# EasyEDA schematic SCH_Probador-de-continuidad-con-NE-555_2026-01-26.json
TITLE: Sheet_1; REV: 1.0; Date: 2025-10-20; Sheet: 1/1; Drawn By: nalaronipin; Company: Your Company
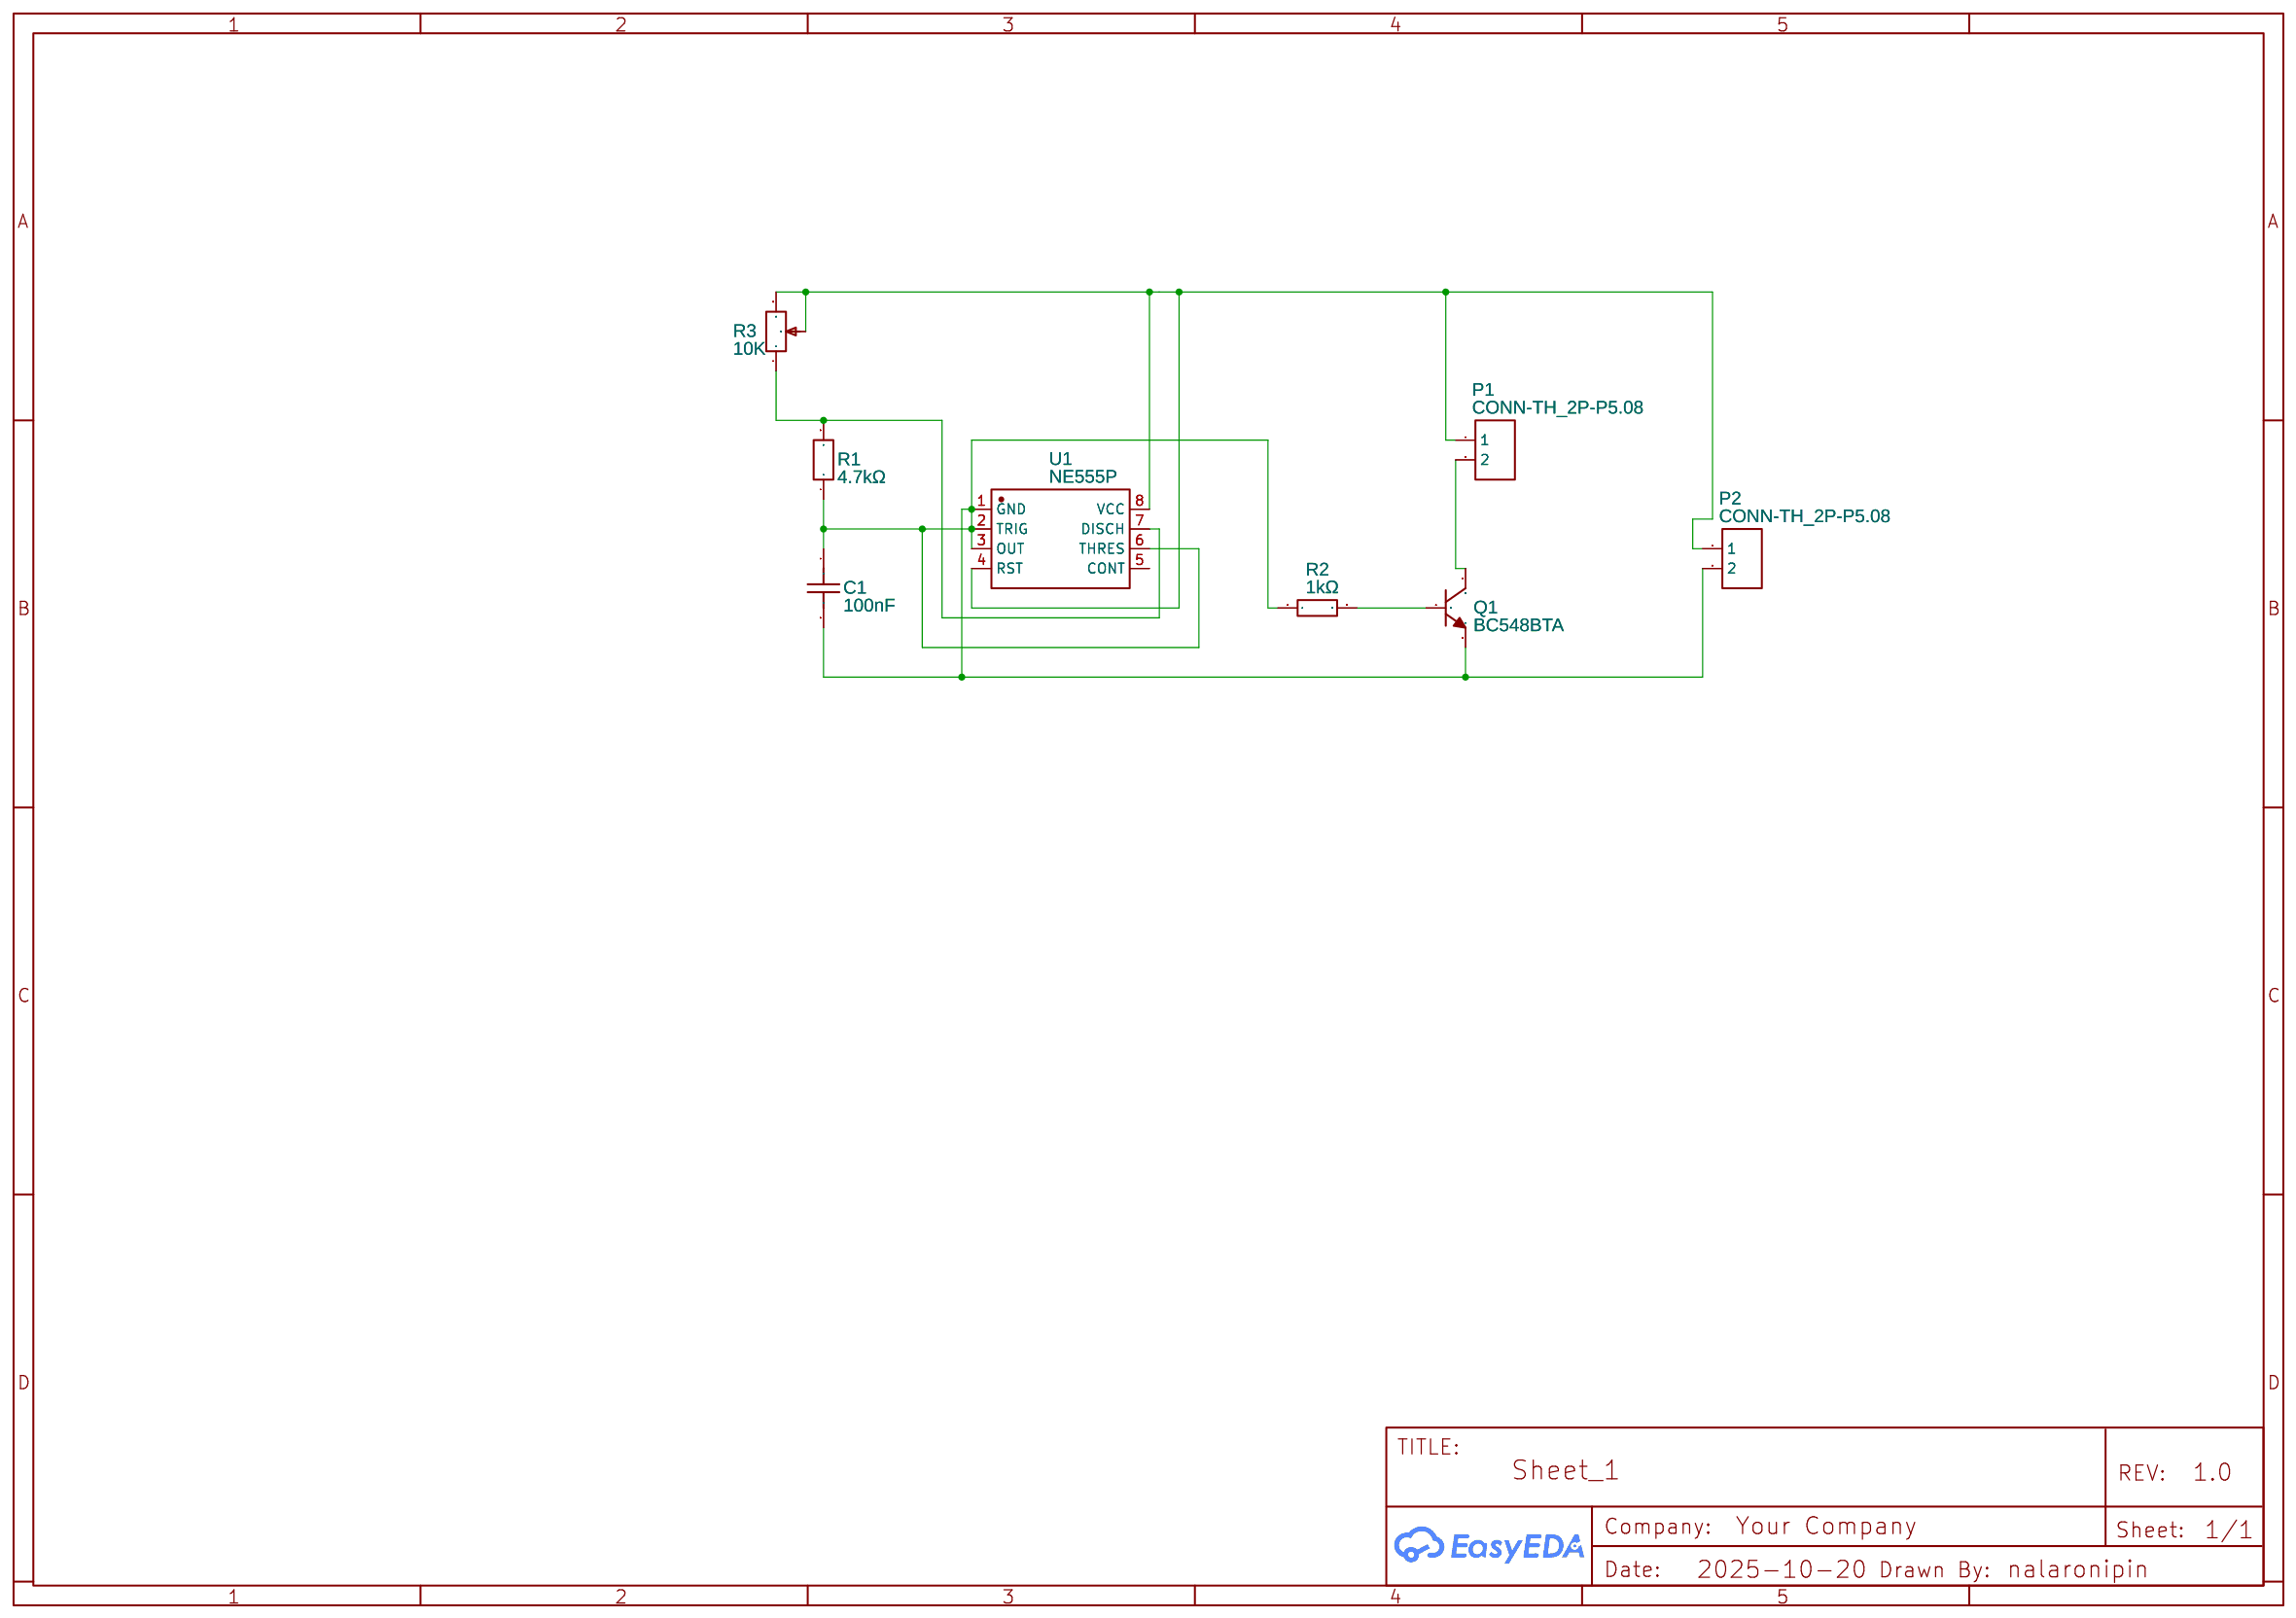
[diagram p0: schematic sheet]

## Parts
C1  100nF  [C0402]
P1  CONN-TH_2P-P5.08  [CONN-TH_2P-P5.08]
P2  CONN-TH_2P-P5.08  [CONN-TH_2P-P5.08]
Q1  BC548BTA  [TO-92-3_L4.8-W3.7-P2.54-L]
R1  4.7kΩ  [RES-TH_BD2.4-L6.3-P10.30-D0.6]
R2  1kΩ  [R0402]
R3  10K  [POTENCIOMETRO10K]
U1  NE555P  [DIP-8_L9.8-W6.6-P2.54-LS7.6-BL]

## Library data of the parts
C1 = 0402X104M250CT: Supplier: LCSC; Supplier Part: C3838494; Manufacturer: Walsin(华新科); JLCPCB Part Class: Extended Part; Contributor: lcsc
P1 P2 = CONN-TH_2P-P5.08: Supplier: LCSC; Contributor: LCEDA_Lib
Q1 = BC548BTA: Contributor: LCSC; Supplier: LCSC; Supplier Part: C900801; Manufacturer: onsemi(安森美); JLCPCB Part Class: Extended Part
R1 = RD 1/4W 4K7 J T/B A1: Contributor: LCSC; Supplier: LCSC; Supplier Part: C433716; Manufacturer: Tyohm(幸亚电阻); JLCPCB Part Class: Extended Part
R2 = 0402 ±5% 1K: Contributor: lcsc; Supplier: LCSC; Supplier Part: C2889347; Manufacturer: VO(翔胜); JLCPCB Part Class: Extended Part
R3 = 10kpotenc: Supplier: LCSC; Manufacturer: ALPS; Manufacturer Part: RK097111080J; Contributor: adriancp; Supplier Part: C97444
U1 = NE555P: Supplier: LCSC; Manufacturer: TI(德州仪器); Supplier Part: C46749; JLCPCB Part Class: Extended Part

## Nets
Net-(C1-1): C1.1 C1.2 P2.2 Q1.3(E) R1.1 R2.1 U1.1(GND) U1.2(TRIG) U1.3(OUT) U1.6(THRES)
Net-(P1-1): P1.1 P2.1 R3.2 R3.3 U1.4(RST) U1.8(VCC)
Net-(P1-2): P1.2 Q1.1(C)
Net-(Q1-2): Q1.2(B) R2.2
Net-(R1-2): R1.2 R3.1 U1.7(DISCH)

Not connected (* = marked no-connect by the designer): U1 5(CONT)
